# Altium schematic sheet P1.schdoc
size 297 x 209 mm; Symbol: Drawing-Symbol_A4; Company: 嘉立创EDA; Version: V1.0; Page Size: A4; @Project Name: New Project_2025-11-14_10-02-11; @Page Count: 1; @Update Date: 2025-11-14; @Create Date: 2025-11-14; @Schematic Name: Schematic1; @Page No: 1; @Page Name: P1; Device: Drawing-Symbol_A4; @Create Time: 10:02:16; @Update Time: 10:02:16; Width: 1170; Height: 825; Region Start: 1; X Region Count: 6; Y Region Count: 4; Blade Width: 10; Title Block Position: 3; @Board Name: Board1
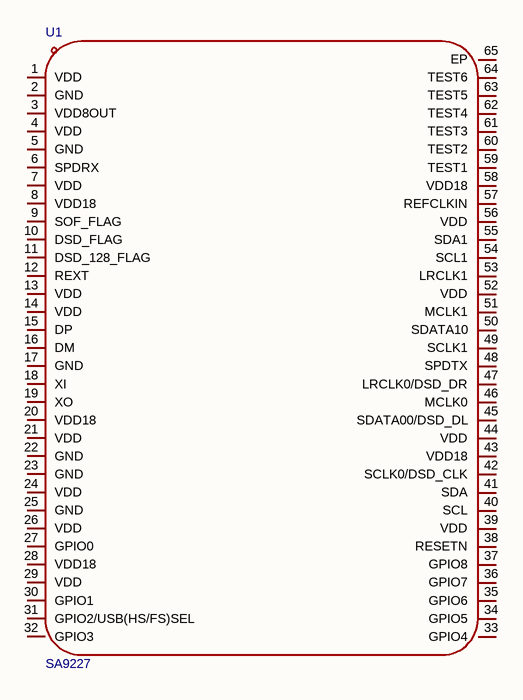
[diagram p0: P1.schdoc]

## Parts
U1  SA9227  [HTQFP-64_L7.0-W7.0-P0.40-LS9.2-BL-EP3.6]

## Nets

Not connected (* = marked no-connect by the designer): U1 1(VDD) 2(GND) 3(VDD8OUT) 4(VDD) 5(GND) 6(SPDRX) 7(VDD) 8(VDD18) 9(SOF_FLAG) 10(DSD_FLAG) 11(DSD_128_FLAG) 12(REXT) 13(VDD) 14(VDD) 15(DP) 16(DM) 17(GND) 18(XI) 19(XO) 20(VDD18) 21(VDD) 22(GND) 23(GND) 24(VDD) 25(GND) 26(VDD) 27(GPIO0) 28(VDD18) 29(VDD) 30(GPIO1) 31(GPIO2/USB(HS/FS)SEL) 32(GPIO3) 33(GPIO4) 34(GPIO5) 35(GPIO6) 36(GPIO7) 37(GPIO8) 38(RESETN) 39(VDD) 40(SCL) 41(SDA) 42(SCLK0/DSD_CLK) 43(VDD18) 44(VDD) 45(SDATA00/DSD_DL) 46(MCLK0) 47(LRCLK0/DSD_DR) 48(SPDTX) 49(SCLK1) 50(SDATA10) 51(MCLK1) 52(VDD) 53(LRCLK1) 54(SCL1) 55(SDA1) 56(VDD) 57(REFCLKIN) 58(VDD18) 59(TEST1) 60(TEST2) 61(TEST3) 62(TEST4) 63(TEST5) 64(TEST6) 65(EP)

## Notes on the sheet
- 1
- 2
- 3
- 4
- 5
- 6
- A
- B
- C
- 创建日期
- 2025-11-14
- 原理图
- 板子
- Schematic1
- Board1
- 更新日期
- 图页
- P1
- D
- 绘制
- 审阅
- New Project_2025-11-14_10-02-11
- 版本
- V1.0
- 尺寸
- A4
- 页    1    共    1
- 嘉立创EDA

## Library data of the parts
U1 = SA9227: 应用功能:-;接口协议:-;; AddInBom: yes; ModelId: 2cb71327e2d24a1c8dfae7b1ec870394; ModelName: HTQFP-64_L7.0-W7.0-H1.2-P0.40-LS9.2-EP3.6; ModelTransform: 362.204,362.204,0,0,0,0,0.002,-0.002,0; Symbol: SA9227; Device: SA9227; LCSC Part Name: SA9227; SupplierPart: C2832043; ManufacturerPart: SA9227; Supplier Footprint: HTQFP-64(7x7); JLCPCB Part Class: Extended Part; Datasheet: https://atta.szlcsc.com/upload/public/pdf/source/20210707/C2832043_63F1B844802D1BB2CC2D02A9E32EC4BE.pdf; Supplier: LCSC; ConvertToPcb: yes; FootprintName: HTQFP-64_L7.0-W7.0-P0.40-LS9.2-BL-EP3.6; Applications Function: -; Protocol: -